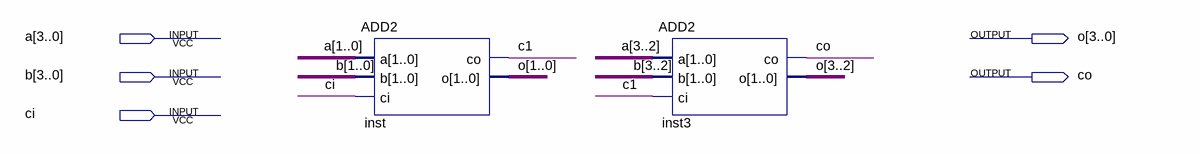
[diagram p0: schematic sheet]
// Quartus schematic ADD4.bdf as structural Verilog: 2 symbols, 5 pins
module ADD4 (
  input  [3:0] a,
  input  [3:0] b,
  input  ci,
  output [3:0] o,
  output co
);

  wire c1;

  ADD2 inst (.a(a[1:0]), .b(b[1:0]), .ci(ci), .co(c1), .o(o[1:0]));
  ADD2 inst3 (.a(a[3:2]), .b(b[3:2]), .ci(c1), .co(co), .o(o[3:2]));
endmodule
